# EAGLE design TMSS.Final (EAGLE 6.5.0)
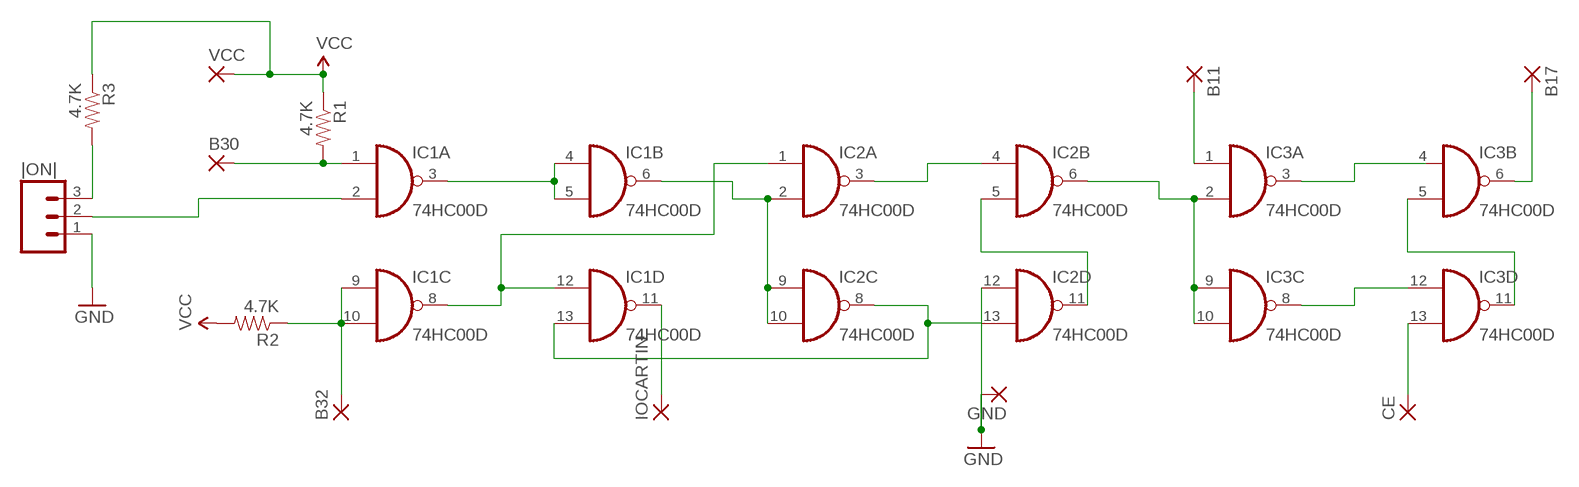
[diagram p0: schematic, sheet 1]

## Parts
B11  1,6/0,9  [1,6/0,9]
B17  1,6/0,9  [1,6/0,9]
B30  1,6/0,9  [1,6/0,9]
B32  1,6/0,9  [1,6/0,9]
CE  1,6/0,9  [1,6/0,9]
GND  1,6/0,9  [1,6/0,9]
IC1  74HC00D  [SO14]
IC2  74HC00D  [SO14]
IC3  74HC00D  [SO14]
IOCARTIN  1,6/0,9  [1,6/0,9]
R1  4.7K  RESISTOR0805-RES  [0805]
R2  4.7K  RESISTOR0805-RES  [0805]
R3  4.7K  RESISTOR0805-RES  [0805]
VCC  1,6/0,9  [1,6/0,9]
|ON|  M03PTH  [1X03]

## Nets
GND: GND.1(P) IC2.12(D:I0) |ON|.1
N$1: IC1.3(A:O) IC1.4(B:I0) IC1.5(B:I1)
N$2: B32.1(P) IC1.9(C:I0) IC1.10(C:I1) R2.1
N$3: IC1.8(C:O) IC1.12(D:I0) IC2.1(A:I0)
N$5: IC1.13(D:I1) IC2.8(C:O) IC2.13(D:I1)
N$6: IC1.6(B:O) IC2.2(A:I1) IC2.9(C:I0) IC2.10(C:I1)
N$7: IC2.3(A:O) IC2.4(B:I0)
N$8: IC2.5(B:I1) IC2.11(D:O)
N$10: IC2.6(B:O) IC3.2(A:I1) IC3.9(C:I0) IC3.10(C:I1)
N$11: IC3.8(C:O) IC3.12(D:I0)
N$12: IC3.3(A:O)
N$13: IC3.5(B:I1) IC3.11(D:O)
N$15: B30.1(P) IC1.1(A:I0) R1.2
N$16: IC1.11(D:O) IOCARTIN.1(P)
N$17: B11.1(P) IC3.1(A:I0)
N$18: B17.1(P) IC3.6(B:O)
N$19: CE.1(P) IC3.13(D:I1)
N$20: IC1.2(A:I1) |ON|.2
N$23: R3.2 |ON|.3
VCC: R1.1 R2.2 R3.1 VCC.1(P)
Unconnected: IC3.4(B:I0)

## Power pins joined to a net without a drawn wire
GND: IC1.7(P:GND) IC2.7(P:GND) IC3.7(P:GND)
VCC: IC1.14(P:VCC) IC2.14(P:VCC) IC3.14(P:VCC)

## Library data of the parts
B11 B17 B30 B32 CE GND IOCARTIN VCC = wirepad:1,6/0,9: THROUGH-HOLE PAD
IC1-IC3 = 74xx-eu:74*00: Quad 2-input NAND gate
R1-R3 = SparkFun-Resistors:RESISTOR: Resistor Basic schematic elements and footprints for 0603, 1206, and PTH resistors.
|ON| = SparkFun-Connectors:M03: Header 3 Standard 3-pin 0.1" header. Use with straight break away headers (SKU : PRT-00116), right angle break away headers (PRT-00553), swiss pins (PRT-00743), machine pins (PRT-00117), and female headers (PRT-00115). Molex polarized connector foot print use with SKU : PRT-08232 with associated crimp pins and housings.

## Board
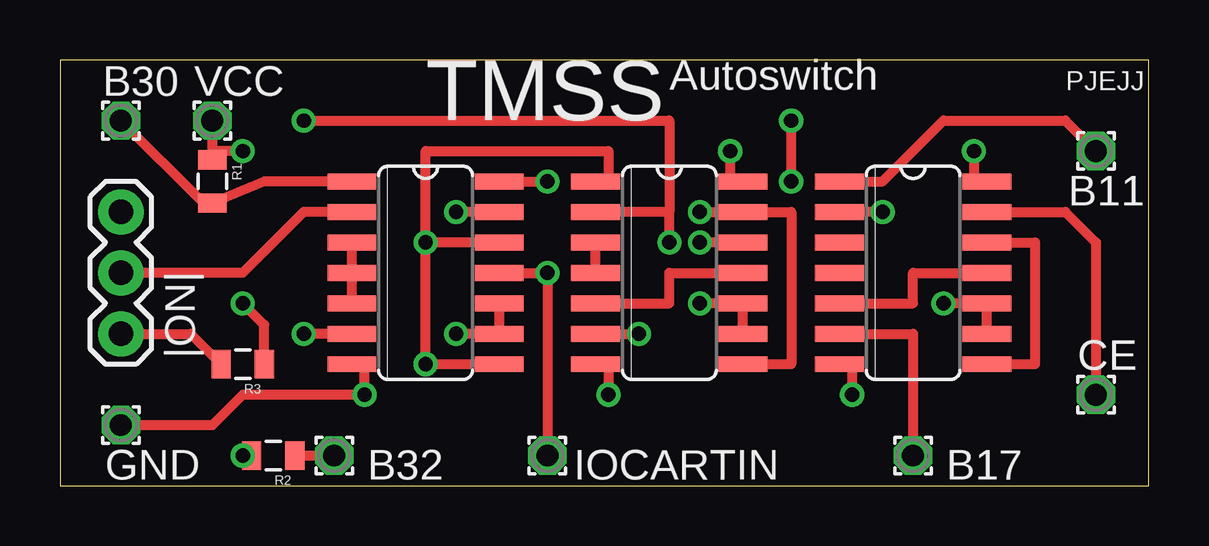
[diagram p1: board, top side]
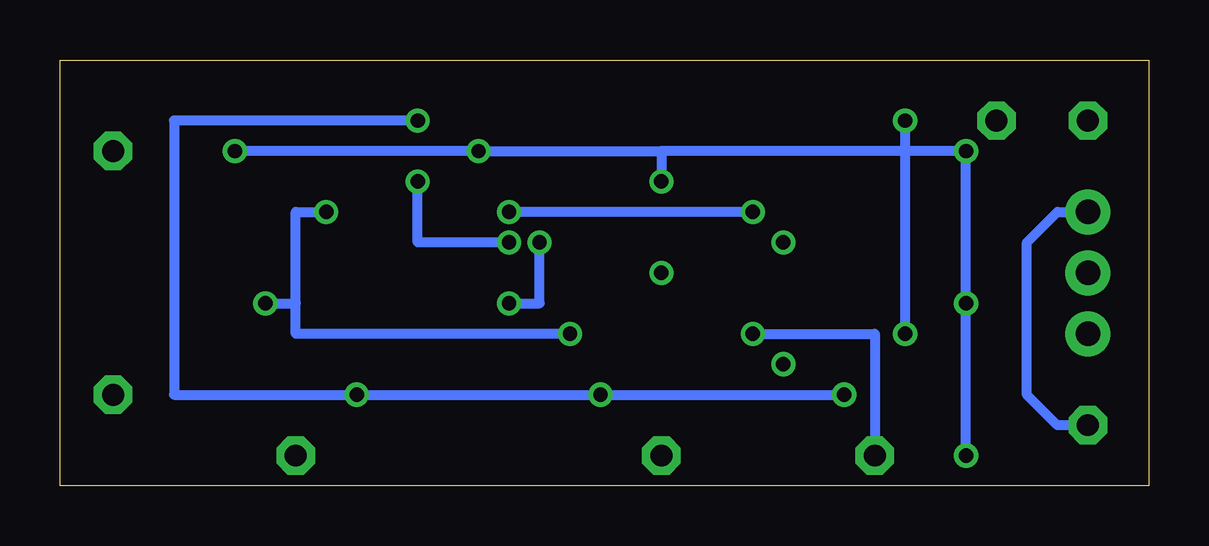
[diagram p2: board, bottom side, seen from below]

Size 45.39 x 17.77 mm. Coordinates in mm from the lower left corner, seen from the top.
Outline: 0,0 45.39,0 45.39,17.77 0,17.77 0,0
Copper layers (1*16): Top 0.035mm / dielectric 1.5mm / Bottom 0.035mm
Design rules "default": minimum track width 10mil, minimum drill 0.6mm, track to track 8mil, track to pad 8mil, pad to pad 8mil, via to via 8mil, smd to smd 8mil, copper to edge 40mil, drill to drill 8mil, minimum pad ring 10mil, minimum via ring 8mil, stop-mask expansion 4mil, vias tented up to drill 0mil, thermal gap 10mil

### Footprints (pad centres in the part's own frame; a part is rotated, then mirrored left to right if it is on the bottom)
1,6/0,9 = drill 0.914 pad 1.6 octagon: 1 0,0
SO14 = smd 0.66 x 2.032: 1 -3.81,-3.073; 2 -2.54,-3.073; 3 -1.27,-3.073; 4 0,-3.073; 5 1.27,-3.073; 6 2.54,-3.073; 7 3.81,-3.073; 8 3.81,3.073; 9 2.54,3.073; 10 1.27,3.073; 11 0,3.073; 12 -1.27,3.073; 13 -2.54,3.073; 14 -3.81,3.073
0805 = smd 0.8 x 1.2: 1 -0.9,0; 2 0.9,0
1X03 = drill 1.016 pad 1.88: 1 0,0; 2 2.54,0; 3 5.08,0

### Placement (x,y rotation side)
B11  43.18,13.97 180 top
B17  35.56,1.27 180 top
B30  2.54,15.24 0 top
B32  11.43,1.27 180 top
CE  43.18,3.81 0 top
GND  2.54,2.54 180 top
IC1  15.24,8.89 270 top
IC2  25.4,8.89 270 top
IC3  35.56,8.89 270 top
IOCARTIN  20.32,1.27 180 top
R1  6.35,12.7 270 top
R2  8.89,1.27 180 top
R3  7.62,5.08 180 top
VCC  6.35,15.24 0 top
|ON|  2.54,11.43 270 top

### Tracks (layer width: path | path; a pad name or v marks a point on that pad's centre or on a via)
GND  (via drill 0.6)
  Top 0.406: IC3.7 33.02,5.08 v33.02,3.81 | IC2.7 22.86,5.08 v22.86,3.81 | IC2.12 v26.67,10.16 | v30.48,12.7 v30.48,15.24 | GND.1 6.35,2.54 7.62,3.81 v12.7,3.81 12.7,5.08 IC1.7
  Bottom 0.406: v12.7,3.81 v22.86,3.81 v33.02,3.81 40.64,3.81 40.64,15.24 v30.48,15.24 | v26.67,10.16 30.48,10.16 v30.48,12.7 | GND.1 3.81,2.54 5.08,3.81 5.08,10.16 3.81,11.43 |ON|.1
N$1
  Top 0.406: IC1.3 IC1.4 IC1.5
N$2  (via drill 0.6)
  Top 0.406: IC1.10 IC1.9 v16.51,6.35 | B32.1 R2.1
  Bottom 0.406: v16.51,6.35 11.43,6.35 B32.1
N$3  (via drill 0.6)
  Top 0.406: IC1.8 v15.24,5.08 v15.24,10.16 | v15.24,10.16 15.24,13.97 22.86,13.97 22.86,12.7 IC2.1 | IC1.12 v15.24,10.16
N$4  (via drill 0.6)
  other vias: 36.83,7.62
N$5  (via drill 0.6)
  Top 0.406: IC2.8 30.48,5.08 30.48,11.43 IC2.13 v26.67,11.43 | IC1.13 v16.51,11.43
  Bottom 0.406: v16.51,11.43 v26.67,11.43
N$6  (via drill 0.6)
  Top 0.406: IC2.9 IC2.10 v26.67,7.62 | v25.4,10.16 25.4,11.43 | 25.4,11.43 IC2.2 | v10.16,15.24 25.4,15.24 25.4,11.43 | IC1.6 v10.16,6.35
  Bottom 0.406: v26.67,7.62 25.4,7.62 v25.4,10.16 | v10.16,6.35 v10.16,15.24
N$7
  Top 0.406: IC2.4 IC2.3
N$8
  Top 0.406: IC2.5 25.4,7.62 25.4,8.89 IC2.11
N$9  (via drill 0.6)
  other vias: 34.29,11.43
N$10  (via drill 0.6)
  Top 0.406: IC3.9 IC3.10 v36.83,7.62 | v34.29,11.43 IC3.2 | IC2.6 v24.13,6.35
  Bottom 0.406: v36.83,7.62 35.56,7.62 | 35.56,7.62 35.56,11.43 v34.29,11.43 | v24.13,6.35 35.56,6.35 35.56,7.62
N$11
  Top 0.406: IC3.12 40.64,10.16 40.64,5.08 IC3.8
N$13
  Top 0.406: IC3.5 35.56,7.62 35.56,8.89 IC3.11
N$14  (via drill 0.6)
  other vias: 26.67,11.43
N$15
  Top 0.406: IC1.1 8.52,12.7 R1.2 5.98,11.8 B30.1
N$16  (via drill 0.6)
  Top 0.406: IC1.11 v20.32,8.89 IOCARTIN.1
N$17
  Top 0.406: IC3.1 34.29,12.7 36.83,15.24 41.91,15.24 B11.1
N$18
  Top 0.406: IC3.6 35.56,6.35 B17.1
N$19
  Top 0.406: IC3.13 41.91,11.43 43.18,10.16 CE.1
N$20
  Top 0.406: IC1.2 10.16,11.43 7.62,8.89 |ON|.2
N$23
  Top 0.406: |ON|.3 5.45,6.35 R3.2
VCC  (via drill 0.6)
  Top 0.406: IC1.14 v20.32,12.7 | IC2.14 27.94,12.7 v27.94,13.97 | IC3.14 38.1,12.7 v38.1,13.97 | VCC.1 R1.1 6.35,13.97 v7.62,13.97 | R2.2 v7.62,1.27 | R3.1 8.52,6.72 v7.62,7.62
  Bottom 0.406: v38.1,13.97 v27.94,13.97 20.32,13.97 | 20.32,13.97 v20.32,12.7 | 20.32,13.97 v7.62,13.97 v7.62,7.62 v7.62,1.27

### Text on the board
tNames: Autoswitch | PJEJJ | TMSS